# Altium schematic sheet ESP32C3_REMOTE_SWITCH_Sheet.SchDoc: ESP32C3_REMOTE
size A4; Author: Hoozz; Organization: Hoozz Play; DocumentNumber: 1; Revision: 1.0; SheetNumber: 1; SheetTotal: 1
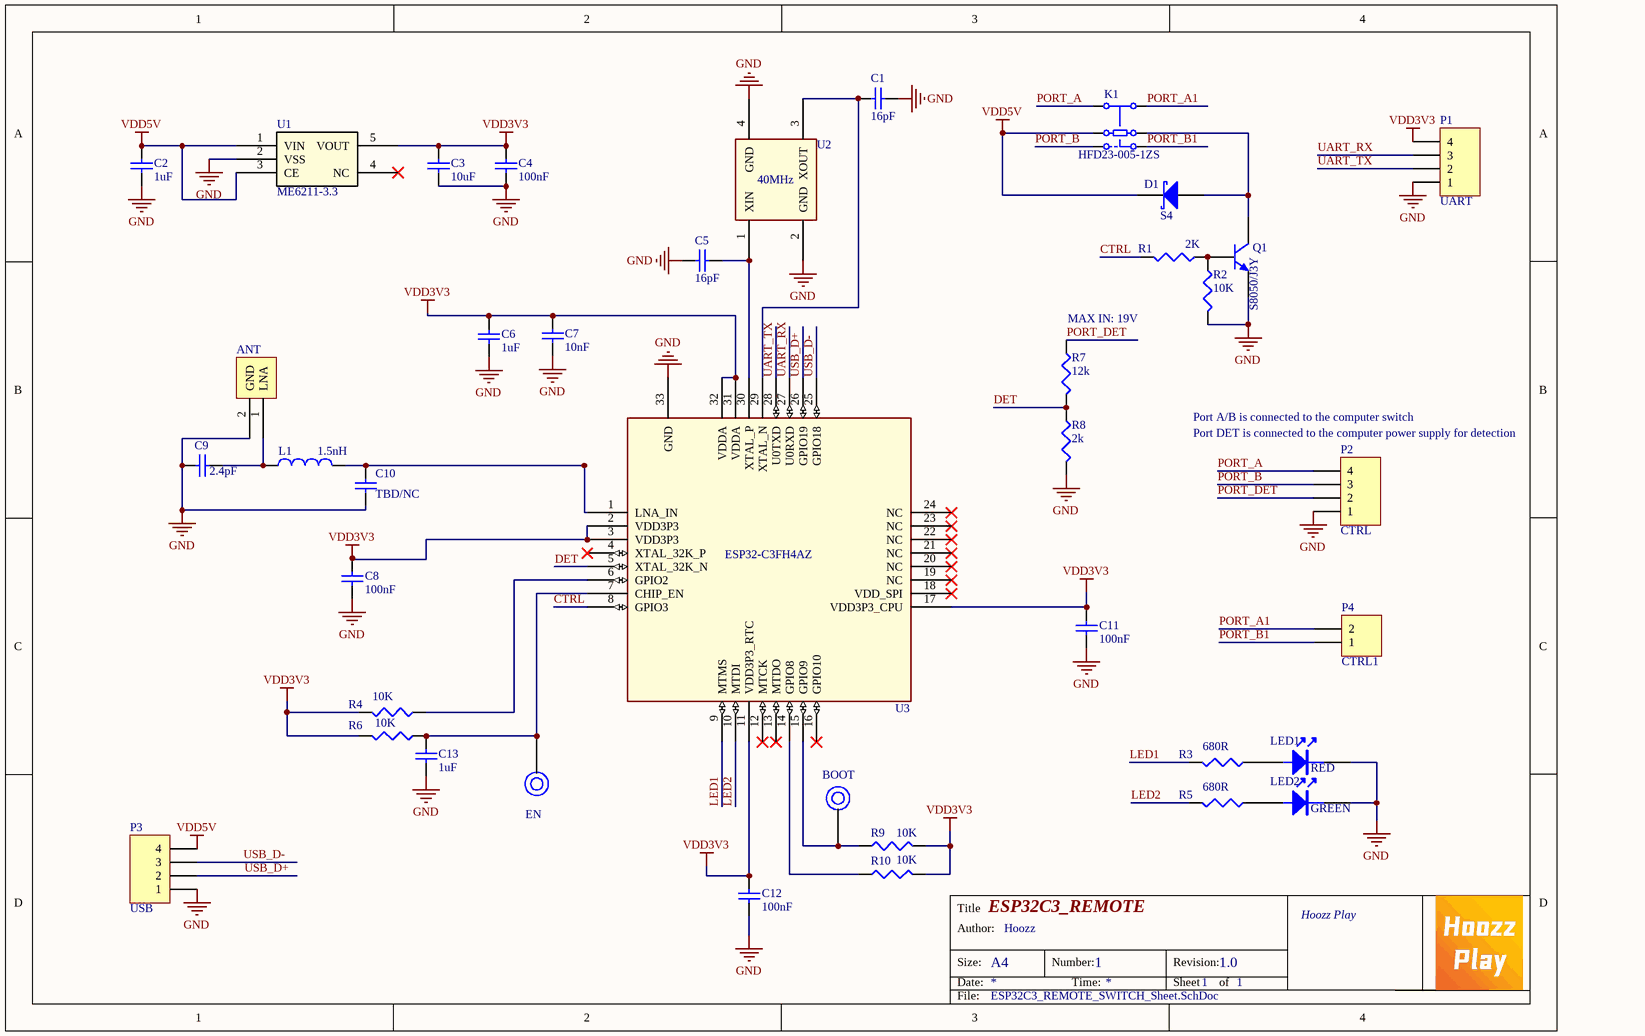
[diagram p0: ESP32C3_REMOTE_SWITCH_Sheet.SchDoc]

## Parts
*1  ANT  [MINI_TI_ANT]
BOOT  TEST-PORT  [TEST-PORT]  (value not drawn)
C1  value 16pF  [0603]  (hidden comment: Cap)
C2  value 1uF  [0603]  (hidden comment: Cap)
C3  value 10uF  [0603]  (hidden comment: Cap)
C4  value 100nF  [0603]  (hidden comment: Cap)
C5  value 16pF  [0603]  (hidden comment: Cap)
C6  value 1uF  [0603]  (hidden comment: Cap)
C7  value 10nF  [0603]  (hidden comment: Cap)
C8  value 100nF  [0603]  (hidden comment: Cap)
C9  value 2.4pF  [0603]  (hidden comment: Cap)
C10  value TBD/NC  [0603]  (hidden comment: Cap)
C11  value 100nF  [0603]  (hidden comment: Cap)
C12  value 100nF  [0603]  (hidden comment: Cap)
C13  value 1uF  [0603]  (hidden comment: Cap)
D1  S4  [SOD-323]
EN  TEST-PORT  [TEST-PORT]  (value not drawn)
K1  HFD23-005-1ZS  [Relay-HFD23]
L1  value 1.5nH  [0603]  (hidden comment: Inductor)
LED1  RED  [LED0603]
LED2  GREEN  [LED0603]
P1  UART  [HDR1X4]
P2  CTRL  [HDR1X4]
P3  USB  [HDR1X4]
P4  CTRL1  [HDR1X2]
Q1  S8050/J3Y  [SOT23_L]
R1  value 2K  [0603]  (hidden comment: Res)
R2  value 10K  [0603]  (hidden comment: Res)
R3  value 680R  [0603]  (hidden comment: Res)
R4  value 10K  [0603]  (hidden comment: Res)
R5  value 680R  [0603]  (hidden comment: Res)
R6  value 10K  [0603]  (hidden comment: Res)
R7  value 12k  [0603]  (hidden comment: Res)
R8  value 2k  [0603]  (hidden comment: Res)
R9  value 10K  [0603]  (hidden comment: Res)
R10  value 10K  [0603]  (hidden comment: Res)
U1  ME6211-3.3  [SOT-23-5]
U2  40MHz  [3225]
U3  ESP32-C3FH4AZ  [QFN32_3.7X3.7]

## Nets
GND: *1.2(GND) C1.2 C2.1 C3.1 C4.1 C5.1 C6.1 C7.1 C8.1 C9.2 C10.1 C11.1 C12.1 C13.1 LED1.2(K) LED2.2(K) P1.1 P2.1 P3.1 Q1.2(E) R2.2 R8.2 U1.2(VSS) U2.2(GND) U2.4(GND) U3.33(GND)
VDD3V3: C3.2 C4.2 C6.2 C7.2 C8.2 C11.2 C12.2 P1.4 R4.2 R6.2 R9.2 R10.2 U1.5(VOUT) U3.2(VDD3P3) U3.3(VDD3P3) U3.11(VDD3P3_RTC) U3.17(VDD3P3_CPU) U3.31(VDDA) U3.32(VDDA)
VDD5V: C2.2 D1.2(K) K1.2 P3.4 U1.1(VIN) U1.3(CE)
CTRL: R1.2 U3.8(GPIO3)
DET: R7.2 R8.1 U3.5(XTAL_32K_N)
LED1: R3.2 U3.9(MTMS)
LED2: R5.2 U3.10(MTDI)
PORT_A: K1.1 P2.4
PORT_A1: K1.6 P4.2
PORT_B: K1.3 P2.3
PORT_B1: K1.4 P4.1
PORT_DET: P2.2 R7.1
UART_RX: P1.3 U3.27(U0RXD)
UART_TX: P1.2 U3.28(U0TXD)
USB_D+: P3.2 U3.26(GPIO19)
USB_D-: P3.3 U3.25(GPIO18)
Net*1_1: *1.1(LNA) C9.1 L1.1
NetBOOT_T: BOOT.T R9.1 U3.15(GPIO9)
NetC1_1: C1.1 U2.3(XOUT) U3.29(XTAL_N)
NetC5_2: C5.2 U2.1(XIN) U3.30(XTAL_P)
NetC10_2: C10.2 L1.2 U3.1(LNA_IN)
NetC13_2: C13.2 EN.T R6.1 U3.7(CHIP_EN)
NetD1_1: D1.1(A) K1.5 Q1.3(C)
NetLED1_1: LED1.1(A) R3.1
NetLED2_1: LED2.1(A) R5.1
NetQ1_1: Q1.1(B) R1.1 R2.1
NetR4_1: R4.1 U3.6(GPIO2)
NetR10_1: R10.1 U3.14(GPIO8)

Not connected (* = marked no-connect by the designer): U1 4(NC)*; U3 4(XTAL_32K_P)* 12(MTCK)* 13(MTDO)* 16(GPIO10)* 18(VDD_SPI)* 19(NC)* 20(NC)* 21(NC)* 22(NC)* 23(NC)* 24(NC)*

## Notes on the sheet
- (near R7) MAX IN: 19V
- (near P2) Port A/B is connected to the computer switch
- (near P2) Port DET is connected to the computer power supply for detection
- Title
- Size:
- Date:
- Author:
- A4
- Number:
- Time:
- Revision:
- Sheet
- of
- File:

## Library data of the parts
C1-C13 = Cap: Capacitor; Published: 8-Jun-2000; LatestRevisionDate: 17-Jul-2002; LatestRevisionNote: Re-released for DXP Platform.; PackageReference: RAD-0.3; Publisher: Altium Limited; PackageDescription: Radial Cap, Thru-Hole; 2 Leads; 0.3 in Pin Spacing
D1 = D Schottky: Schottky Diode; Published: 8-Jun-2000; LatestRevisionDate: 17-Jul-2002; LatestRevisionNote: Re-released for DXP Platform.; PackageReference: SMB; Publisher: Altium Limited; PackageDescription: DO-214-AA/SMB; 2 C-Bend Leads; Body 5.3 x 3.6 mm, inc. leads (LxW); Code_JEDEC: DO-214-AA
K1 = Relay-HFD23: Published: 24-Mar-1999; LatestRevisionDate: 17-Jul-2002; LatestRevisionNote: Re-released for DXP Platform.; PackageReference: MODULE4; Publisher: Altium Limited
L1 = Inductor: Code_IEC: 1005; Published: 8-Jun-2000; LatestRevisionDate: 29-May-2009; LatestRevisionNote: IPC-7351 Footprint Added.; PackageReference: 0402-A; Publisher: Altium Limited; PackageDescription: Chip Inductor; Code_JEITA: 0402
LED1 LED2 = LED
P1-P3 = Header 4: Header, 4-Pin; LatestRevisionDate: 17-Jul-2002; LatestRevisionNote: Re-released for DXP Platform.; Publisher: Altium Limited
P4 = Header 2: Header, 2-Pin; LatestRevisionDate: 17-Jul-2002; LatestRevisionNote: Re-released for DXP Platform.; Publisher: Altium Limited
Q1 = NPN: Published: 8-Jun-2000; LatestRevisionDate: 17-Jul-2002; LatestRevisionNote: Re-released for DXP Platform.; PackageReference: TO-226-AA; Publisher: Altium Limited; PackageDescription: TO, Flat Index; 3 In-Line, Axial Leads; Body Dia. 4.8mm; Leads 0.55 x 0.51 mm (max); Code_JEDEC: TO-226-AA
R1-R10 = Res: Resistor; Published: 8-Jun-2000; LatestRevisionDate: 29-May-2009; LatestRevisionNote: IPC-7351 Footprint Added.; PackageReference: J1-0603; Publisher: Altium Limited; PackageDescription: Chip Resistor
U1 = ME6211-3.3: Manufacturer: Texas Instruments; Manufacturer_Part_Number: REG102NA-2.5/250; Built_By: EMA_UL_Team; SourceLibrary: TI_2016-07-06; Vendor: Texas Instruments; Copyright: Copyright (C) 2018 Accelerated Designs. All rights reserved; RefDes: RefDes; Type: DEV
U2 = XTAL2